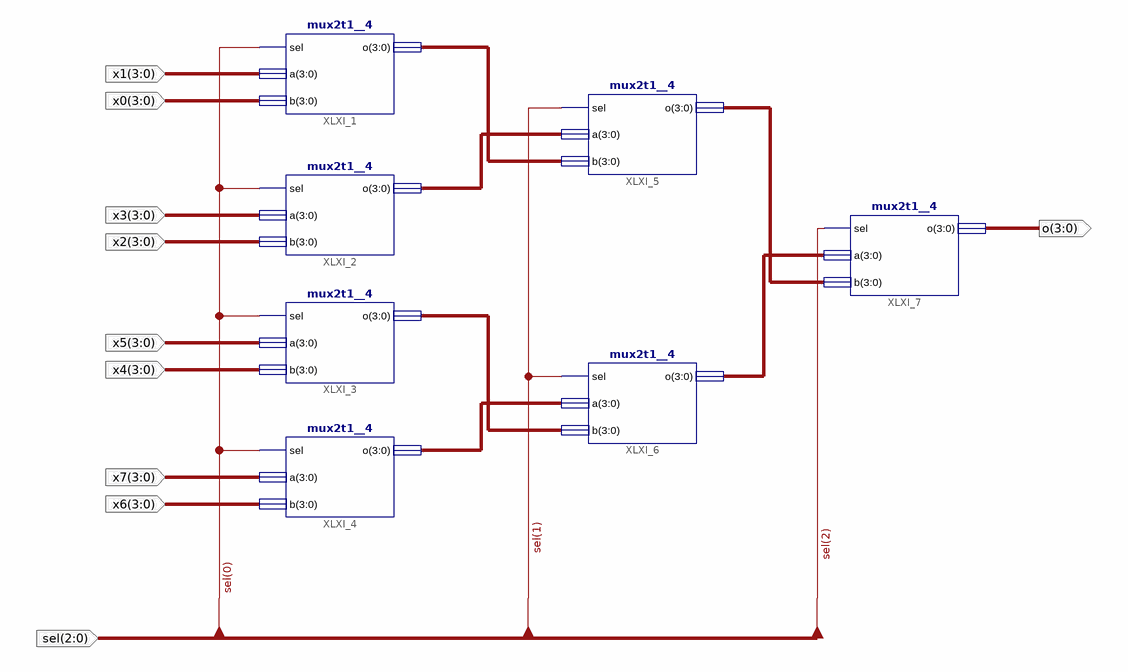
[diagram p0: schematic sheet 1]
// Xilinx ISE schematic mux8t1__4.sch (kintex7) as structural Verilog: 7 symbols, 10 ports
module mux8t1__4 (
  input  [2:0] sel,
  input  [3:0] x1,
  input  [3:0] x0,
  input  [3:0] x3,
  input  [3:0] x2,
  input  [3:0] x5,
  input  [3:0] x4,
  input  [3:0] x7,
  input  [3:0] x6,
  output [3:0] o
);

  wire [3:0] XLXN_2, XLXN_3, XLXN_4, XLXN_5, XLXN_6, XLXN_7;

  mux2t1__4 XLXI_1 (.sel(sel[0]), .a(x1), .b(x0), .o(XLXN_2));
  mux2t1__4 XLXI_2 (.sel(sel[0]), .a(x3), .b(x2), .o(XLXN_3));
  mux2t1__4 XLXI_3 (.sel(sel[0]), .a(x5), .b(x4), .o(XLXN_4));
  mux2t1__4 XLXI_4 (.sel(sel[0]), .a(x7), .b(x6), .o(XLXN_5));
  mux2t1__4 XLXI_5 (.sel(sel[1]), .a(XLXN_3), .b(XLXN_2), .o(XLXN_6));
  mux2t1__4 XLXI_6 (.sel(sel[1]), .a(XLXN_5), .b(XLXN_4), .o(XLXN_7));
  mux2t1__4 XLXI_7 (.sel(sel[2]), .a(XLXN_7), .b(XLXN_6), .o(o));
endmodule
